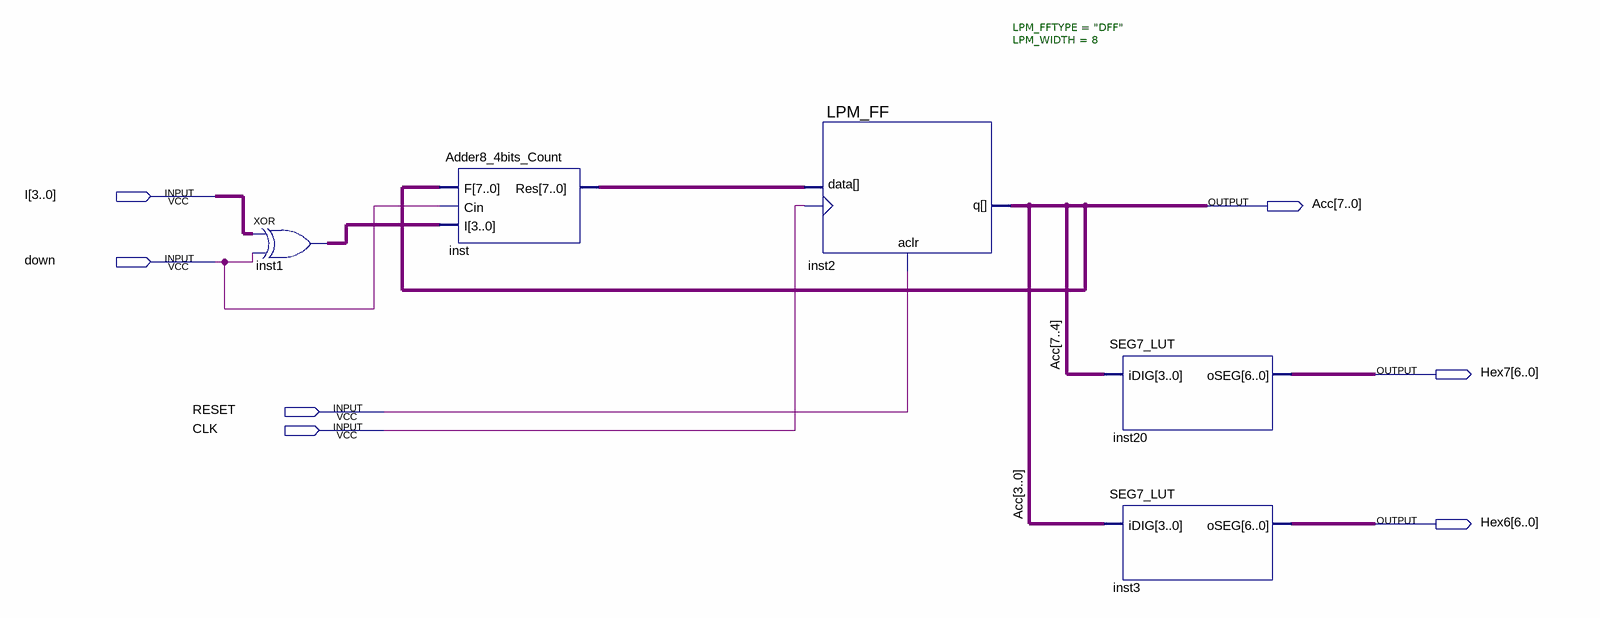
[diagram p0: schematic sheet]
// Quartus schematic ModdedAccumulator.bdf as structural Verilog: 5 symbols, 7 pins
module ModdedAccumulator (
  input  [3:0] I,
  input  down,
  input  RESET,
  input  CLK,
  output [7:0] Acc,
  output [6:0] Hex7,
  output [6:0] Hex6
);

  wire [3:0] inst1_out;
  wire [7:0] inst_res;

  assign inst1_out = I ^ {4{down}};  // XOR inst1, 4 bits wide
  Adder8_4bits_Count inst (.F(Acc), .Cin(down), .I(inst1_out), .Res(inst_res));
  LPM_FF #(.LPM_FFTYPE("DFF"), .LPM_WIDTH(8)) inst2 (.aclr(RESET), .clock(CLK), .data(inst_res), .q(Acc));
  SEG7_LUT inst20 (.iDIG(Acc[7:4]), .oSEG(Hex7));
  SEG7_LUT inst3 (.iDIG(Acc[3:0]), .oSEG(Hex6));
endmodule
